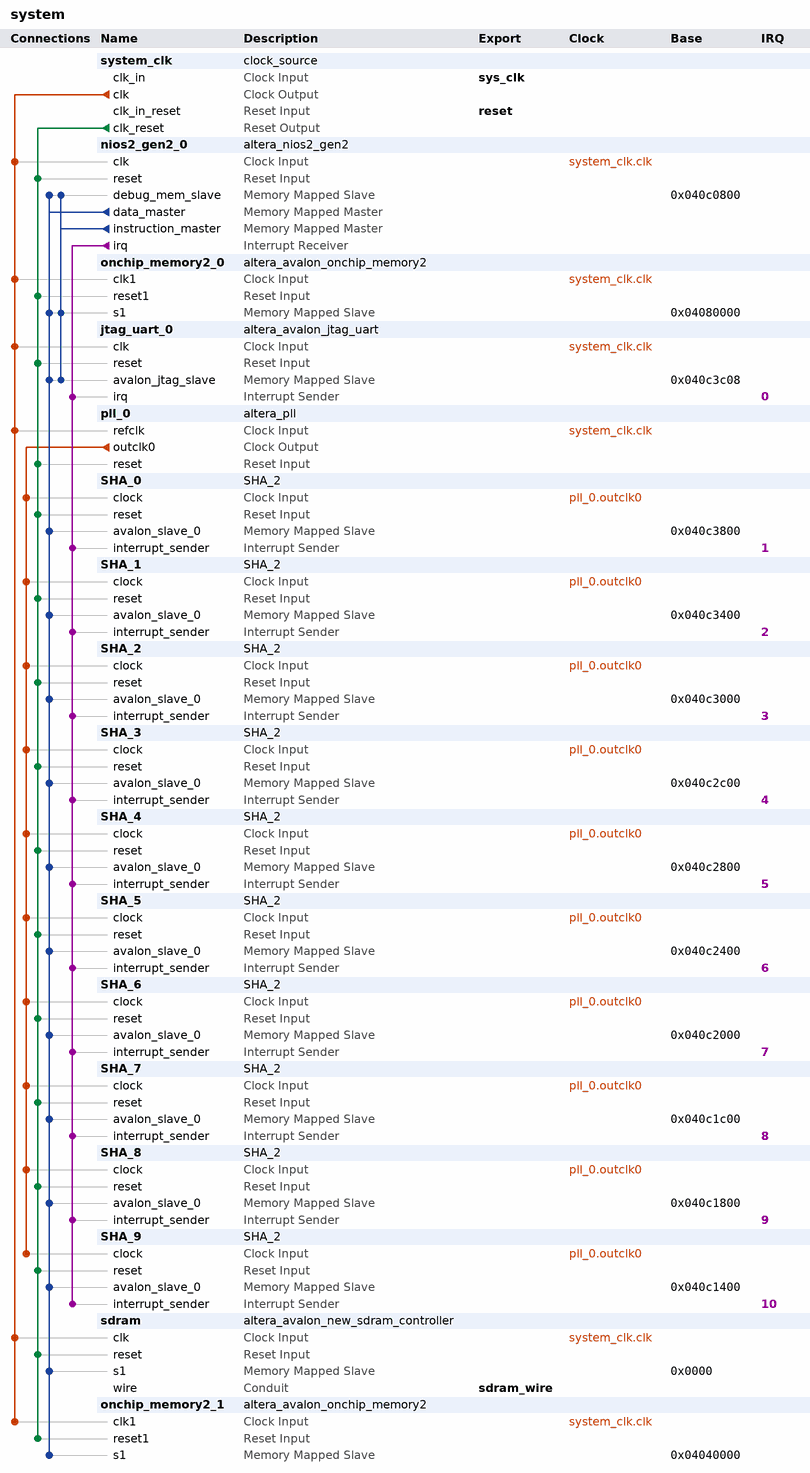
[diagram p0: system contents]
# Platform Designer (Qsys) system system, Cyclone V 5CSXFC6D6F31C6
# Parameters at their usual value, and those the tool derives, are not listed.
package require -exact qsys 18.1
create_system system
set_project_property DEVICE_FAMILY {Cyclone V}
set_project_property DEVICE 5CSXFC6D6F31C6

add_instance system_clk clock_source 18.1
set_instance_parameter_value system_clk clockFrequency 50000000

add_instance nios2_gen2_0 altera_nios2_gen2 18.1
set_instance_parameter_value nios2_gen2_0 dcache_size 2048
set_instance_parameter_value nios2_gen2_0 exceptionSlave onchip_memory2_0.s1
set_instance_parameter_value nios2_gen2_0 icache_size 4096
set_instance_parameter_value nios2_gen2_0 impl Tiny
set_instance_parameter_value nios2_gen2_0 resetSlave onchip_memory2_0.s1

add_instance onchip_memory2_0 altera_avalon_onchip_memory2 18.1
set_instance_parameter_value onchip_memory2_0 dataWidth 32
set_instance_parameter_value onchip_memory2_0 dualPort false
set_instance_parameter_value onchip_memory2_0 initMemContent true
set_instance_parameter_value onchip_memory2_0 initializationFileName onchip_mem.hex
set_instance_parameter_value onchip_memory2_0 memorySize 256000

add_instance jtag_uart_0 altera_avalon_jtag_uart 18.1
set_instance_parameter_value jtag_uart_0 simInteractiveOptions NO_INTERACTIVE_WINDOWS

add_instance pll_0 altera_pll 18.1
set_instance_parameter_value pll_0 gui_device_speed_grade 1
set_instance_parameter_value pll_0 gui_number_of_clocks 1
set_instance_parameter_value pll_0 gui_operation_mode direct
set_instance_parameter_value pll_0 gui_output_clock_frequency0 75.0
set_instance_parameter_value pll_0 gui_pll_mode {Integer-N PLL}
set_instance_parameter_value pll_0 gui_reference_clock_frequency 50.0
set_instance_parameter_value pll_0 gui_use_locked true

add_instance SHA_0 SHA_2 1.0

add_instance SHA_1 SHA_2 1.0

add_instance SHA_2 SHA_2 1.0

add_instance SHA_3 SHA_2 1.0

add_instance SHA_4 SHA_2 1.0

add_instance SHA_5 SHA_2 1.0

add_instance SHA_6 SHA_2 1.0

add_instance SHA_7 SHA_2 1.0

add_instance SHA_8 SHA_2 1.0

add_instance SHA_9 SHA_2 1.0

add_instance sdram altera_avalon_new_sdram_controller 18.1
set_instance_parameter_value sdram TAC 5.5
set_instance_parameter_value sdram TRCD 20.0
set_instance_parameter_value sdram TRP 20.0
set_instance_parameter_value sdram casLatency 3
set_instance_parameter_value sdram columnWidth 10
set_instance_parameter_value sdram dataWidth 16
set_instance_parameter_value sdram generateSimulationModel false
set_instance_parameter_value sdram model single_Micron_MT48LC4M32B2_7_chip
set_instance_parameter_value sdram numberOfBanks 4
set_instance_parameter_value sdram numberOfChipSelects 1
set_instance_parameter_value sdram powerUpDelay 100.0
set_instance_parameter_value sdram refreshPeriod 15.625
set_instance_parameter_value sdram rowWidth 13

add_instance onchip_memory2_1 altera_avalon_onchip_memory2 18.1
set_instance_parameter_value onchip_memory2_1 dataWidth 32
set_instance_parameter_value onchip_memory2_1 dualPort false
set_instance_parameter_value onchip_memory2_1 initMemContent true
set_instance_parameter_value onchip_memory2_1 initializationFileName onchip_mem.hex
set_instance_parameter_value onchip_memory2_1 memorySize 256000

# connections
add_connection pll_0.outclk0 SHA_0.clock clock
add_connection pll_0.outclk0 SHA_1.clock clock
add_connection pll_0.outclk0 SHA_2.clock clock
add_connection pll_0.outclk0 SHA_3.clock clock
add_connection pll_0.outclk0 SHA_4.clock clock
add_connection pll_0.outclk0 SHA_5.clock clock
add_connection pll_0.outclk0 SHA_6.clock clock
add_connection pll_0.outclk0 SHA_7.clock clock
add_connection pll_0.outclk0 SHA_8.clock clock
add_connection pll_0.outclk0 SHA_9.clock clock
add_connection system_clk.clk jtag_uart_0.clk clock
add_connection system_clk.clk nios2_gen2_0.clk clock
add_connection system_clk.clk onchip_memory2_0.clk1 clock
add_connection system_clk.clk onchip_memory2_1.clk1 clock
add_connection system_clk.clk pll_0.refclk clock
add_connection system_clk.clk sdram.clk clock
add_connection system_clk.clk_reset jtag_uart_0.reset reset
add_connection system_clk.clk_reset nios2_gen2_0.reset reset
add_connection system_clk.clk_reset onchip_memory2_0.reset1 reset
add_connection system_clk.clk_reset onchip_memory2_1.reset1 reset
add_connection system_clk.clk_reset pll_0.reset reset
add_connection system_clk.clk_reset sdram.reset reset
add_connection system_clk.clk_reset SHA_0.reset reset
add_connection system_clk.clk_reset SHA_1.reset reset
add_connection system_clk.clk_reset SHA_2.reset reset
add_connection system_clk.clk_reset SHA_3.reset reset
add_connection system_clk.clk_reset SHA_4.reset reset
add_connection system_clk.clk_reset SHA_5.reset reset
add_connection system_clk.clk_reset SHA_6.reset reset
add_connection system_clk.clk_reset SHA_7.reset reset
add_connection system_clk.clk_reset SHA_8.reset reset
add_connection system_clk.clk_reset SHA_9.reset reset
add_connection nios2_gen2_0.data_master jtag_uart_0.avalon_jtag_slave avalon
set_connection_parameter_value nios2_gen2_0.data_master/jtag_uart_0.avalon_jtag_slave baseAddress 0x040c3c08
add_connection nios2_gen2_0.data_master nios2_gen2_0.debug_mem_slave avalon
set_connection_parameter_value nios2_gen2_0.data_master/nios2_gen2_0.debug_mem_slave baseAddress 0x040c0800
add_connection nios2_gen2_0.data_master onchip_memory2_0.s1 avalon
set_connection_parameter_value nios2_gen2_0.data_master/onchip_memory2_0.s1 baseAddress 0x04080000
add_connection nios2_gen2_0.data_master onchip_memory2_1.s1 avalon
set_connection_parameter_value nios2_gen2_0.data_master/onchip_memory2_1.s1 baseAddress 0x04040000
add_connection nios2_gen2_0.data_master sdram.s1 avalon
set_connection_parameter_value nios2_gen2_0.data_master/sdram.s1 baseAddress 0x0000
add_connection nios2_gen2_0.data_master SHA_0.avalon_slave_0 avalon
set_connection_parameter_value nios2_gen2_0.data_master/SHA_0.avalon_slave_0 baseAddress 0x040c3800
add_connection nios2_gen2_0.data_master SHA_1.avalon_slave_0 avalon
set_connection_parameter_value nios2_gen2_0.data_master/SHA_1.avalon_slave_0 baseAddress 0x040c3400
add_connection nios2_gen2_0.data_master SHA_2.avalon_slave_0 avalon
set_connection_parameter_value nios2_gen2_0.data_master/SHA_2.avalon_slave_0 baseAddress 0x040c3000
add_connection nios2_gen2_0.data_master SHA_3.avalon_slave_0 avalon
set_connection_parameter_value nios2_gen2_0.data_master/SHA_3.avalon_slave_0 baseAddress 0x040c2c00
add_connection nios2_gen2_0.data_master SHA_4.avalon_slave_0 avalon
set_connection_parameter_value nios2_gen2_0.data_master/SHA_4.avalon_slave_0 baseAddress 0x040c2800
add_connection nios2_gen2_0.data_master SHA_5.avalon_slave_0 avalon
set_connection_parameter_value nios2_gen2_0.data_master/SHA_5.avalon_slave_0 baseAddress 0x040c2400
add_connection nios2_gen2_0.data_master SHA_6.avalon_slave_0 avalon
set_connection_parameter_value nios2_gen2_0.data_master/SHA_6.avalon_slave_0 baseAddress 0x040c2000
add_connection nios2_gen2_0.data_master SHA_7.avalon_slave_0 avalon
set_connection_parameter_value nios2_gen2_0.data_master/SHA_7.avalon_slave_0 baseAddress 0x040c1c00
add_connection nios2_gen2_0.data_master SHA_8.avalon_slave_0 avalon
set_connection_parameter_value nios2_gen2_0.data_master/SHA_8.avalon_slave_0 baseAddress 0x040c1800
add_connection nios2_gen2_0.data_master SHA_9.avalon_slave_0 avalon
set_connection_parameter_value nios2_gen2_0.data_master/SHA_9.avalon_slave_0 baseAddress 0x040c1400
add_connection nios2_gen2_0.instruction_master jtag_uart_0.avalon_jtag_slave avalon
set_connection_parameter_value nios2_gen2_0.instruction_master/jtag_uart_0.avalon_jtag_slave baseAddress 0x040c3c08
add_connection nios2_gen2_0.instruction_master nios2_gen2_0.debug_mem_slave avalon
set_connection_parameter_value nios2_gen2_0.instruction_master/nios2_gen2_0.debug_mem_slave baseAddress 0x040c0800
add_connection nios2_gen2_0.instruction_master onchip_memory2_0.s1 avalon
set_connection_parameter_value nios2_gen2_0.instruction_master/onchip_memory2_0.s1 baseAddress 0x04080000
add_connection nios2_gen2_0.irq jtag_uart_0.irq interrupt
set_connection_parameter_value nios2_gen2_0.irq/jtag_uart_0.irq irqNumber 0
add_connection nios2_gen2_0.irq SHA_0.interrupt_sender interrupt
set_connection_parameter_value nios2_gen2_0.irq/SHA_0.interrupt_sender irqNumber 1
add_connection nios2_gen2_0.irq SHA_1.interrupt_sender interrupt
set_connection_parameter_value nios2_gen2_0.irq/SHA_1.interrupt_sender irqNumber 2
add_connection nios2_gen2_0.irq SHA_2.interrupt_sender interrupt
set_connection_parameter_value nios2_gen2_0.irq/SHA_2.interrupt_sender irqNumber 3
add_connection nios2_gen2_0.irq SHA_3.interrupt_sender interrupt
set_connection_parameter_value nios2_gen2_0.irq/SHA_3.interrupt_sender irqNumber 4
add_connection nios2_gen2_0.irq SHA_4.interrupt_sender interrupt
set_connection_parameter_value nios2_gen2_0.irq/SHA_4.interrupt_sender irqNumber 5
add_connection nios2_gen2_0.irq SHA_5.interrupt_sender interrupt
set_connection_parameter_value nios2_gen2_0.irq/SHA_5.interrupt_sender irqNumber 6
add_connection nios2_gen2_0.irq SHA_6.interrupt_sender interrupt
set_connection_parameter_value nios2_gen2_0.irq/SHA_6.interrupt_sender irqNumber 7
add_connection nios2_gen2_0.irq SHA_7.interrupt_sender interrupt
set_connection_parameter_value nios2_gen2_0.irq/SHA_7.interrupt_sender irqNumber 8
add_connection nios2_gen2_0.irq SHA_8.interrupt_sender interrupt
set_connection_parameter_value nios2_gen2_0.irq/SHA_8.interrupt_sender irqNumber 9
add_connection nios2_gen2_0.irq SHA_9.interrupt_sender interrupt
set_connection_parameter_value nios2_gen2_0.irq/SHA_9.interrupt_sender irqNumber 10

# exported interfaces
add_interface reset reset sink
set_interface_property reset EXPORT_OF system_clk.clk_in_reset
add_interface sdram_wire conduit end
set_interface_property sdram_wire EXPORT_OF sdram.wire
add_interface sys_clk clock sink
set_interface_property sys_clk EXPORT_OF system_clk.clk_in

set_interconnect_requirement {$system} qsys_mm.clockCrossingAdapter HANDSHAKE
set_interconnect_requirement {$system} qsys_mm.enableEccProtection FALSE
set_interconnect_requirement {$system} qsys_mm.insertDefaultSlave FALSE
set_interconnect_requirement {$system} qsys_mm.maxAdditionalLatency 1

save_system system.qsys
